# EAGLE design E-P-001-R2.0 (EAGLE 7.3.0)
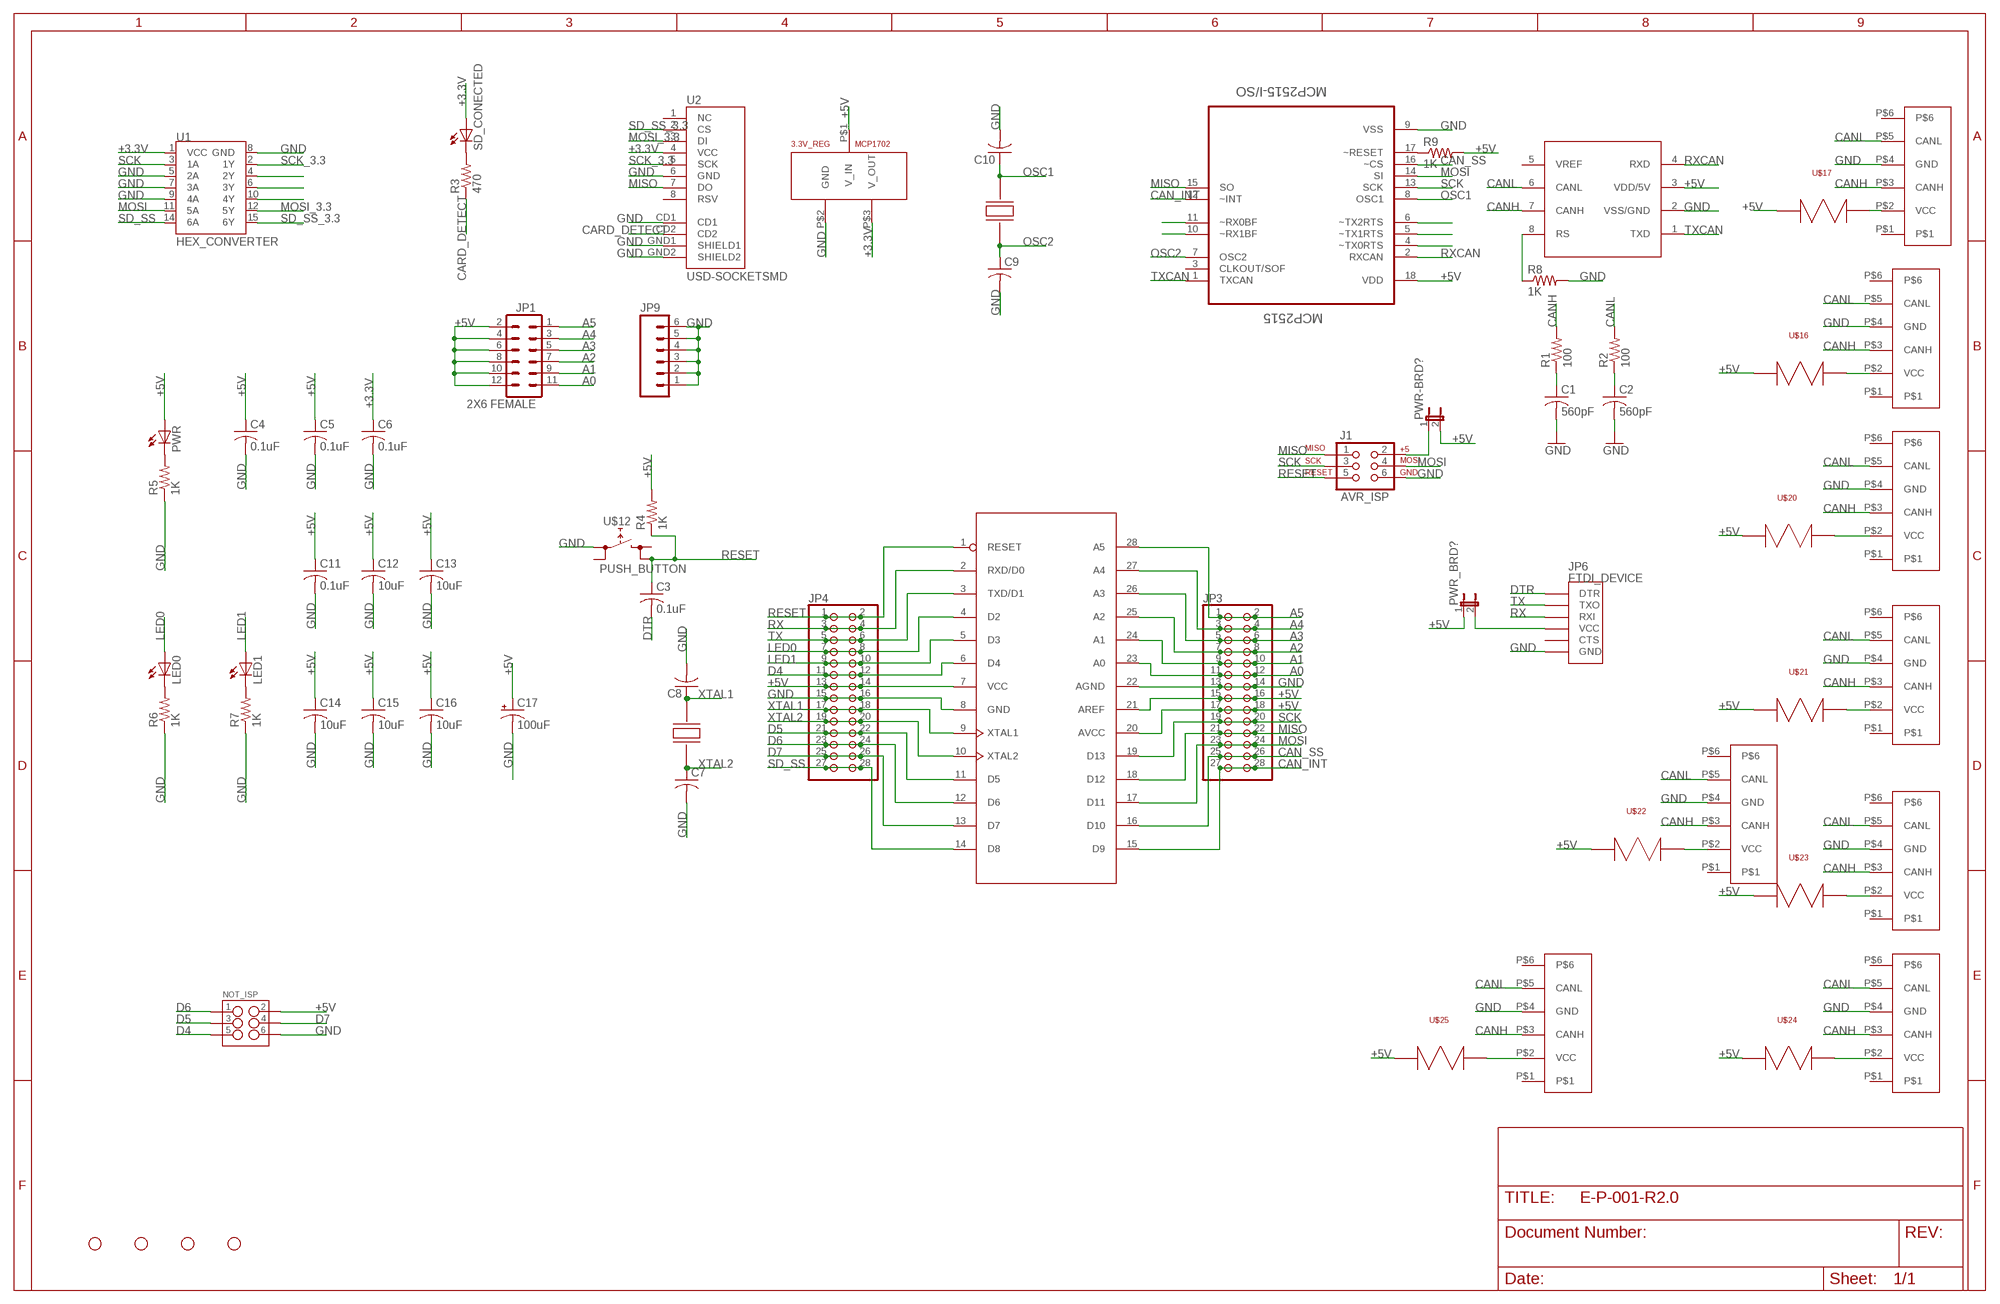
[diagram p0: schematic, sheet 1]

## Parts
3.3V_REG  MCP1702  [SOT-23A]
C1  560pF  C-USC0805  [C0805]
C2  560pF  C-USC0805  [C0805]
C3  0.1uF  C-USC0805  [C0805]
C4  0.1uF  C-USC0805  [C0805]
C5  0.1uF  C-USC0805  [C0805]
C6  0.1uF  C-USC0805  [C0805]
C7  C-USC0805  [C0805]
C8  C-USC0805  [C0805]
C9  C-USC0805  [C0805]
C10  C-USC0805  [C0805]
C11  0.1uF  C-USC0805  [C0805]
C12  10uF  C-USC0805  [C0805]
C13  10uF  C-USC0805  [C0805]
C14  10uF  C-USC0805  [C0805]
C15  10uF  C-USC0805  [C0805]
C16  10uF  C-USC0805  [C0805]
C17  100uF  47UF-50V-20%(ELECT)  [PANASONIC_D]
J1  AVR_ISP  AVR_SPI_PRG_6PTH  [2X3]
JP1  2X6 FEMALE  M06X2PTH_FEMALE  [2X6]
JP3  PINHD-2X14  [2X14]
JP4  PINHD-2X14  [2X14]
JP6  FTDI_DEVICE  [FTDI_DEVICE_SIDE]
JP9  M06SILK_FEMALE_PTH  [1X06]
LED0  LED1206  [LED-1206]
LED1  LED1206  [LED-1206]
MCP2515  MCP2515-I/SO  [SOIC127P1034X264-18N]
NOT_ISP  M03X2FEMALE  [2X3]
PWR  LED1206  [LED-1206]
PWR-BRD?  JP1E  [JP1]
PWR_BRD?  JP1E  [JP1]
R1  100  R-US_M0805  [M0805]
R2  100  R-US_M0805  [M0805]
R3  470  R-US_M0805  [M0805]
R4  1K  R-US_M0805  [M0805]
R5  1K  R-US_M0805  [M0805]
R6  1K  R-US_M0805  [M0805]
R7  1K  R-US_M0805  [M0805]
R8  1K  R-US_M0805  [M0805]
R9  1K  R-US_M0805  [M0805]
SD_CONECTED  LED1206  [LED-1206]
STANDOFF1  STAND-OFF  [STAND-OFF]
STANDOFF2  STAND-OFF  [STAND-OFF]
STANDOFF3  STAND-OFF  [STAND-OFF]
STANDOFF4  STAND-OFF  [STAND-OFF]
U1  HEX_CONVERTER  [SO016]
U2  USD-SOCKETSMD  [MICRO-SD-SOCKET-PP]
U$1  CAN_6P6C  [CAN_6P6C]
U$2  MCP2551DIP  [DIP8]
U$4  ATMEGA328  [DIP28-0.3IN]
U$6  CAN_6P6C  [CAN_6P6C]
U$7  CAN_6P6C  [CAN_6P6C]
U$8  CAN_6P6C  [CAN_6P6C]
U$9  CAN_6P6C  [CAN_6P6C]
U$10  CAN_6P6C  [CAN_6P6C]
U$11  CAN_6P6C  [CAN_6P6C]
U$12  PUSH_BUTTON  [PUSHBUTTON]
U$14  CAN_6P6C  [CAN_6P6C]
U$16  FUSE  [SM_MINI_AUTO-FUSE_HOLDER]
U$17  FUSE  [SM_MINI_AUTO-FUSE_HOLDER]
U$18  CRYSTAL  [7A_CRYSTAL]
U$19  CRYSTAL  [7A_CRYSTAL]
U$20  FUSE  [SM_MINI_AUTO-FUSE_HOLDER]
U$21  FUSE  [SM_MINI_AUTO-FUSE_HOLDER]
U$22  FUSE  [SM_MINI_AUTO-FUSE_HOLDER]
U$23  FUSE  [SM_MINI_AUTO-FUSE_HOLDER]
U$24  FUSE  [SM_MINI_AUTO-FUSE_HOLDER]
U$25  FUSE  [SM_MINI_AUTO-FUSE_HOLDER]

## Nets
+3.3V: 3.3V_REG.P$3(V_OUT) C6.1 SD_CONECTED.A U1.1(VCC) U2.4(VCC)
+5V: 3.3V_REG.P$1(V_IN) C4.1 C5.1 C11.1 C12.1 C13.1 C14.1 C15.1 C16.1 C17.+ JP1.2 JP1.4 JP1.6 JP1.8 JP1.10 JP1.12 JP3.15 JP3.16 JP3.17 JP3.18 JP4.13 JP4.14 MCP2515.18(VDD) NOT_ISP.2 PWR-BRD?.2 PWR.A PWR_BRD?.1 R4.2 R9.2 U$2.3(VDD/5V) U$4.7(VCC) U$4.20(AVCC) U$4.21(AREF) U$16.P$3 U$16.P$4 U$17.P$3 U$17.P$4 U$20.P$3 U$20.P$4 U$21.P$3 U$21.P$4 U$22.P$3 U$22.P$4 U$23.P$3 U$23.P$4 U$24.P$3 U$24.P$4 U$25.P$3 U$25.P$4
A0: JP1.11 JP3.11 JP3.12 U$4.23(A0)
A1: JP1.9 JP3.9 JP3.10 U$4.24(A1)
A2: JP1.7 JP3.7 JP3.8 U$4.25(A2)
A3: JP1.5 JP3.5 JP3.6 U$4.26(A3)
A4: JP1.3 JP3.3 JP3.4 U$4.27(A4)
A5: JP1.1 JP3.1 JP3.2 U$4.28(A5)
CAN_INT: JP3.27 JP3.28 MCP2515.12(~INT) U$4.15(D9)
CAN_SS: JP3.25 JP3.26 MCP2515.16(~CS) U$4.16(D10)
CANH: R1.2 U$1.P$3(CANH) U$2.7(CANH) U$6.P$3(CANH) U$7.P$3(CANH) U$8.P$3(CANH) U$9.P$3(CANH) U$10.P$3(CANH) U$11.P$3(CANH) U$14.P$3(CANH)
CANL: R2.2 U$1.P$5(CANL) U$2.6(CANL) U$6.P$5(CANL) U$7.P$5(CANL) U$8.P$5(CANL) U$9.P$5(CANL) U$10.P$5(CANL) U$11.P$5(CANL) U$14.P$5(CANL)
CARD_DETECT: R3.1 U2.CD2
D4: JP4.11 JP4.12 NOT_ISP.5 U$4.6(D4)
D5: JP4.21 JP4.22 NOT_ISP.3 U$4.11(D5)
D6: JP4.23 JP4.24 NOT_ISP.1 U$4.12(D6)
D7: JP4.25 JP4.26 NOT_ISP.4 U$4.13(D7)
DTR: C3.2 JP6.P$1(DTR)
GND: 3.3V_REG.P$2(GND) C1.2 C2.2 C4.2 C5.2 C6.2 C7.2 C8.2 C9.2 C10.2 C11.2 C12.2 C13.2 C14.2 C15.2 C16.2 C17.- J1.6 JP3.13 JP3.14 JP4.15 JP4.16 JP6.P$6(GND) JP9.1 JP9.2 JP9.3 JP9.4 JP9.5 JP9.6 MCP2515.9(VSS) NOT_ISP.6 R5.1 R6.1 R7.1 R8.2 U1.5(2A) U1.7(3A) U1.8(GND) U1.9(4A) U2.6(GND) U2.CD1 U2.GND1(SHIELD1) U2.GND2(SHIELD2) U$1.P$4(GND) U$2.2(VSS/GND) U$4.8(GND) U$4.22(AGND) U$6.P$4(GND) U$7.P$4(GND) U$8.P$4(GND) U$9.P$4(GND) U$10.P$4(GND) U$11.P$4(GND) U$12.L1(L) U$14.P$4(GND)
LED0: JP4.7 JP4.8 LED0.A U$4.4(D2)
LED1: JP4.9 JP4.10 LED1.A U$4.5(D3)
MISO: J1.1 JP3.21 JP3.22 MCP2515.15(SO) U2.7(DO) U$4.18(D12)
MOSI: J1.4 JP3.23 JP3.24 MCP2515.14(SI) U1.11(5A) U$4.17(D11)
MOSI_3.3: U1.12(5Y) U2.3(DI)
N$1: MCP2515.4(~TX0RTS)
N$2: MCP2515.5(~TX1RTS)
N$3: MCP2515.6(~TX2RTS)
N$4: MCP2515.11(~RX0BF)
N$5: U$14.P$2(VCC) U$22.P$1 U$22.P$2
N$6: U$11.P$2(VCC) U$25.P$1 U$25.P$2
N$7: R3.2 SD_CONECTED.C
N$9: JP6.P$4(VCC) PWR_BRD?.2
N$10: LED0.C R6.2
N$11: LED1.C R7.2
N$12: R8.1 U$2.8(RS)
N$15: MCP2515.17(~RESET) R9.1
N$17: U$10.P$2(VCC) U$24.P$1 U$24.P$2
N$19: PWR.C R5.2
N$21: U$9.P$2(VCC) U$23.P$1 U$23.P$2
N$22: U$8.P$2(VCC) U$21.P$1 U$21.P$2
N$23: U$7.P$2(VCC) U$20.P$1 U$20.P$2
N$24: MCP2515.10(~RX1BF)
N$25: C1.1 R1.1
N$26: C2.1 R2.1
N$27: U1.4(2Y)
N$28: U1.6(3Y)
N$29: U1.10(4Y)
N$30: U$6.P$2(VCC) U$16.P$1 U$16.P$2
N$31: U$1.P$2(VCC) U$17.P$1 U$17.P$2
N$37: J1.2 PWR-BRD?.1
OSC1: C10.1 MCP2515.8(OSC1) U$19.P$2
OSC2: C9.1 MCP2515.7(OSC2) U$19.P$1
RESET: C3.1 J1.5 JP4.1 JP4.2 R4.1 U$4.1(RESET) U$12.R2(R)
RX: JP4.3 JP4.4 JP6.P$3(RXI) U$4.2(RXD/D0)
RXCAN: MCP2515.2(RXCAN) U$2.4(RXD)
SCK: J1.3 JP3.19 JP3.20 MCP2515.13(SCK) U1.3(1A) U$4.19(D13)
SCK_3.3: U1.2(1Y) U2.5(SCK)
SD_SS: JP4.27 JP4.28 U1.14(6A) U$4.14(D8)
SD_SS_3.3: U1.15(6Y) U2.2(CS)
TX: JP4.5 JP4.6 JP6.P$2(TXO) U$4.3(TXD/D1)
TXCAN: MCP2515.1(TXCAN) U$2.1(TXD)
XTAL1: C8.1 JP4.17 JP4.18 U$4.9(XTAL1) U$18.P$2
XTAL2: C7.1 JP4.19 JP4.20 U$4.10(XTAL2) U$18.P$1
Unconnected: JP6.P$5(CTS) MCP2515.3(CLKOUT/SOF) U2.1(NC) U2.8(RSV) U$1.P$1 U$1.P$6 U$2.5(VREF) U$6.P$1 U$6.P$6 U$7.P$1 U$7.P$6 U$8.P$1 U$8.P$6 U$9.P$1 U$9.P$6 U$10.P$1 U$10.P$6 U$11.P$1 U$11.P$6 U$12.L2(L) U$12.R1(R) U$14.P$1 U$14.P$6

## Library data of the parts
3.3V_REG = mylibrary:MCP1702
C1-C16 = adafruit:C-US: CAPACITOR, American symbol
C17 = SparkFun-Capacitors:47UF-50V-20%(ELECT): CAP-10547; PROD_ID: CAP-10547
J1 = E-P-099-R2.2:AVR_SPI_PRG_6: AVR ISP 6 Pin This is the reduced ISP connector for AVR programming. Common on Arduino. This footprint will take up less PCB space and can be used with a 10-pin to 6-pin adapter such as SKU: BOB-08508
JP1 = SparkFun-Connectors:M06X2; PROD_ID: CONN-12423
JP3 JP4 = E-P-099-R2.2:PINHD-2X14: PIN HEADER
JP6 = SparkFun-Connectors:FTDI_DEVICE: Connector which mates to FTDI basic or FTDI cable.
JP9 = SparkFun-Connectors:M06: Header 6 Standard 6-pin 0.1" header. Use with straight break away headers (SKU : PRT-00116), right angle break away headers (PRT-00553), swiss pins (PRT-00743), machine pins (PRT-00117), and female headers (PRT-00115). Molex polarized connector foot print use with SKU : PRT-08094 with associated crimp pins and housings. NOTES ON THE VARIANTS LOCK and LOCK_LONGPADS... This footprint was designed to help hold the alignment of a through-hole component (i.e. 6-pin header) while soldering it into place. You may notice that each hole has been shifted either up or down by 0.005 of an inch from it's more standard position (which is a perfectly straight line). This slight alteration caused the pins (the squares in the middle) to touch the edges of the holes. Because they are alternating, it causes a "brace" to hold the component in place. 0.005 has proven to be the perfect amount of "off-center" position when using our standard breakaway headers. Although looks a little odd when you look at the bare footprint, once you have a header in there, the alteration is very hard to notice. Also,if you push a header all the way into place, it is covered up entirely on the bottom side. This idea of altering the position of holes to aid alignment will be further integrated into the Sparkfun Library for other footprints. It can help hold any component with 3 or more connection pins.; PROD_ID: CONN-08437
LED0 LED1 PWR SD_CONECTED = Shell2013:LED: LEDs Standard schematic elements and footprints for 5mm, 3mm, 1206, and 0603 sized LEDs. 5mm - Spark Fun Electronics SKU : COM-00529 (and others)
MCP2515 = Microchip_By_element14_Batch_1:MCP2515-I/SO: CAN Controller; MPN: MCP2515-I/SO; OC_FARNELL: 1292239; OC_NEWARK: 29H7136; PACKAGE: SOIC-18; SUPPLIER: Microchip
NOT_ISP = SparkFun-Connectors:M03X2: 2x3 .1" header. Shrouded, with keying- CONN-10681 SMT- CONN-11415 Pogo pins- HW-11044; PROD_ID: CONN-11566; VALUE: FEMALE 2x3
PWR-BRD? PWR_BRD? = E-P-099-R2.2:JP1E: JUMPER
R1-R9 = adafruit:R-US_: RESISTOR, American symbol
STANDOFF1-STANDOFF4 = SparkFun-Electromechanical:STAND-OFF: #4 Stand Off This is the mechanical footprint for a #4 phillips button head screw. Use the keepout ring to avoid running the screw head into surrounding components. SKU : PRT-00447
U1 = SparkFun-DigitalIC:HEX_CONVERTER: 74HC4050 Hex Buffer Level Shifter SMD SO016; PROD_ID: IC-09604
U2 = SparkFun:USD-SOCKET: microSD Socket Push-push type uSD socket. Schematic element and footprint production proven. Spark Fun Electronics SKU : PRT-00127. tDoc lines correctly indicate media card edge positions when inserting (unlocked, locked, depressed).
U$1 U$6-U$11 U$14 = Shell2013:CAN_6P6C: Digikey part: 553-2258-ND
U$2 = E-P-099-R2.2:MCP2551
U$4 = E-P-099-R2.2:ATMEGA328
U$12 = E-P-099-R2.2:PUSH_BUTTON
U$16 U$17 U$20-U$25 = mylibrary:FUSE
U$18 U$19 = mylibrary:CRYSTAL

## Board
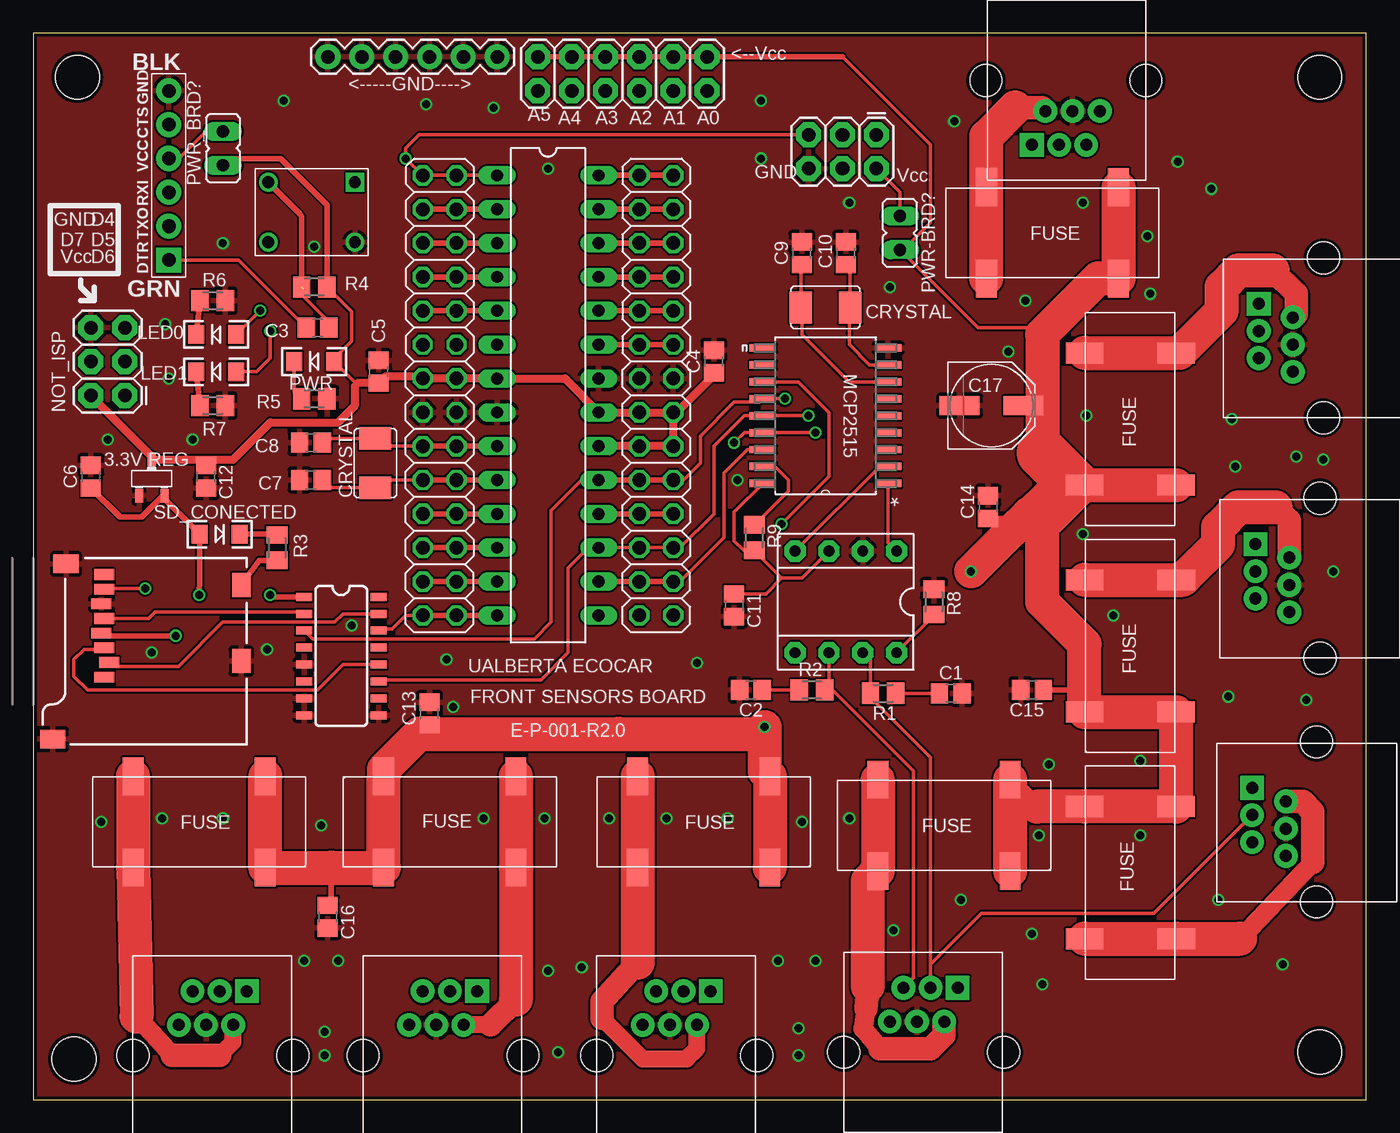
[diagram p1: board, top side]
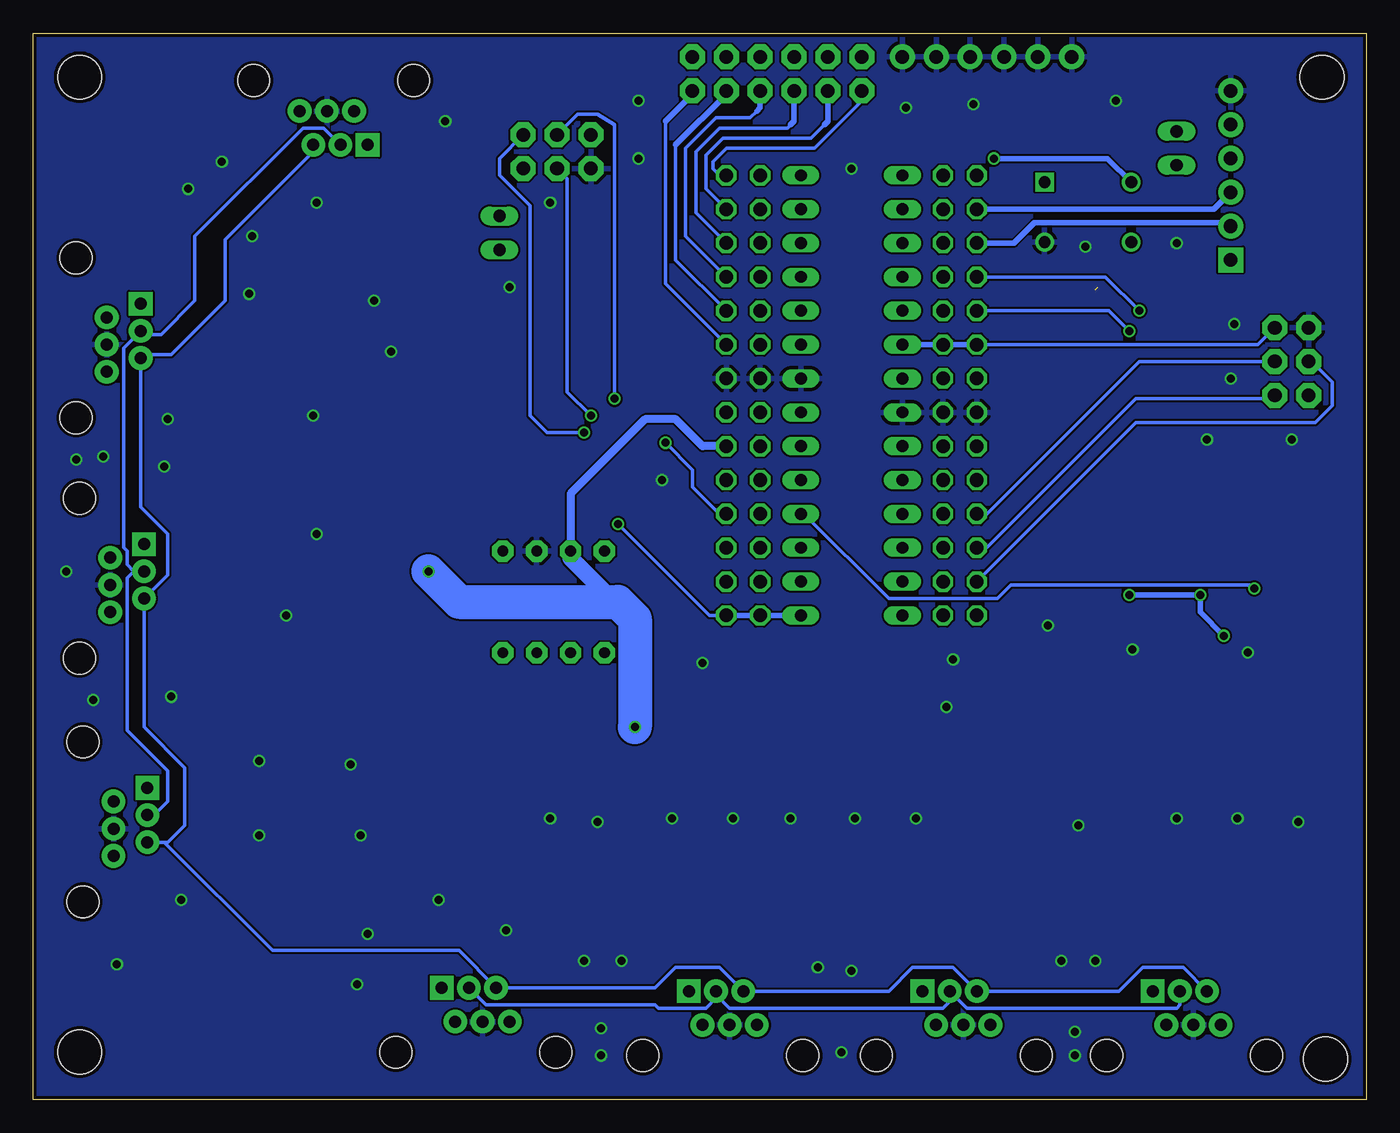
[diagram p2: board, bottom side, seen from below]

Size 100 x 80 mm. Coordinates in mm from the lower left corner, seen from the top.
Outline: 0,0 100,0 100,80 0,80 0,0
Copper layers (1*16): Top 0.035mm / dielectric 1.5mm / Bottom 0.035mm
Design rules "ITEADstudio_DRC": minimum track width 6mil, minimum drill 12mil, track to track 6mil, track to pad 6mil, pad to pad 6mil, via to via 6mil, smd to smd 0mil, copper to edge 10mil, drill to drill 10mil, minimum pad ring 10mil, minimum via ring 6mil, stop-mask expansion 2mil, vias tented up to drill 100mil, thermal gap 10mil

### Footprints (pad centres in the part's own frame; a part is rotated, then mirrored left to right if it is on the bottom)
SOT-23A = smd 0.6 x 1: P$1 0,0; P$2 -0.95,-2.7; P$3 0.95,-2.7
C0805 = smd 1.3 x 1.5: 1 -0.85,0; 2 0.85,0
PANASONIC_D = smd 3 x 1.4: + 2.4,0; - -2.4,0
2X3 = drill 1.016 pad 1.88 octagon: 1 0,0; 2 0,2.54; 3 2.54,0; 4 2.54,2.54; 5 5.08,0; 6 5.08,2.54
2X6 = drill 1.016 pad 1.88 octagon: 1 0,0; 2 0,2.54; 3 2.54,0; 4 2.54,2.54; 5 5.08,0; 6 5.08,2.54; 7 7.62,0; 8 7.62,2.54; 9 10.16,0; 10 10.16,2.54; 11 12.7,0; 12 12.7,2.54
2X14 = drill 1.016 octagon: 1 -16.51,-1.27; 2 -16.51,1.27; 3 -13.97,-1.27; 4 -13.97,1.27; 5 -11.43,-1.27; 6 -11.43,1.27; 7 -8.89,-1.27; 8 -8.89,1.27; 9 -6.35,-1.27; 10 -6.35,1.27; 11 -3.81,-1.27; 12 -3.81,1.27; 13 -1.27,-1.27; 14 -1.27,1.27; 15 1.27,-1.27; 16 1.27,1.27; 17 3.81,-1.27; 18 3.81,1.27; 19 6.35,-1.27; 20 6.35,1.27; 21 8.89,-1.27; 22 8.89,1.27; 23 11.43,-1.27; 24 11.43,1.27; 25 13.97,-1.27; 26 13.97,1.27; 27 16.51,-1.27; 28 16.51,1.27
FTDI_DEVICE_SIDE = drill 1.016 pad 1.88 square: P$1 -6.35,0 | drill 1.016 pad 1.88: P$2 -3.81,0; P$3 -1.27,0; P$4 1.27,0; P$5 3.81,0; P$6 6.35,0
1X06 = drill 1.016 pad 1.88: 1 0,0; 2 2.54,0; 3 5.08,0; 4 7.62,0; 5 10.16,0; 6 12.7,0
LED-1206 = smd 1.2 x 1.4: A -1.5,0; C 1.5,0
SOIC127P1034X264-18N = smd 1.981 x 0.559: 1 -4.699,5.08; 2 -4.699,3.81; 3 -4.699,2.54; 4 -4.699,1.27; 5 -4.699,0; 6 -4.699,-1.27; 7 -4.699,-2.54; 8 -4.699,-3.81; 9 -4.699,-5.08; 10 4.699,-5.08; 11 4.699,-3.81; 12 4.699,-2.54; 13 4.699,-1.27; 14 4.699,0; 15 4.699,1.27; 16 4.699,2.54; 17 4.699,3.81; 18 4.699,5.08
JP1 = drill 0.914 long: 1 0,-1.27; 2 0,1.27
M0805 = smd 1.3 x 1.6: 1 -0.95,0; 2 0.95,0
STAND-OFF = hole 3.302: 0,0
SO016 = smd 0.6 x 1.2: 1 -4.445,-2.8; 2 -3.175,-2.8; 3 -1.905,-2.8; 4 -0.635,-2.8; 5 0.635,-2.8; 6 1.905,-2.8; 7 3.175,-2.8; 8 4.445,-2.8; 9 4.445,2.8; 10 3.175,2.8; 11 1.905,2.8; 12 0.635,2.8; 13 -0.635,2.8; 14 -1.905,2.8; 15 -3.175,2.8; 16 -4.445,2.8
MICRO-SD-SOCKET-PP = smd 0.8 x 1.5: 1 -8.94,10.7; 2 -7.84,10.3; 3 -6.74,10.7; 4 -5.64,10.9; 5 -4.54,10.7; 6 -3.44,10.9; 7 -2.34,10.7; 8 -1.24,10.7 | smd 1.8 x 1.4: CD1 -7.75,0.4; CD2 -2.05,0.4 | smd 1.4 x 1.9: GND1 -13.6,14.55; GND2 -0.45,13.55
CAN_6P6C = drill 0.9 pad 1.778 square: P$1 4.08,0 | drill 0.9 pad 1.778: P$2 3.06,-2.54; P$3 2.04,0; P$4 1.02,-2.54; P$5 0,0; P$6 -1.02,-2.54 | hole 2.4: -4.47,-4.84; 7.53,-4.84
DIP8 = drill 0.813 pad 1.6 octagon: 1 1.27,-3.81; 2 3.81,-3.81; 3 6.35,-3.81; 4 8.89,-3.81; 5 8.89,3.81; 6 6.35,3.81; 7 3.81,3.81; 8 1.27,3.81
DIP28-0.3IN = drill 0.889 long: 1 -16.51,-3.81; 2 -13.97,-3.81; 3 -11.43,-3.81; 4 -8.89,-3.81; 5 -6.35,-3.81; 6 -3.81,-3.81; 7 -1.27,-3.81; 8 1.27,-3.81; 9 3.81,-3.81; 10 6.35,-3.81; 11 8.89,-3.81; 12 11.43,-3.81; 13 13.97,-3.81; 14 16.51,-3.81; 15 16.51,3.81; 16 13.97,3.81; 17 11.43,3.81; 18 8.89,3.81; 19 6.35,3.81; 20 3.81,3.81; 21 1.27,3.81; 22 -1.27,3.81; 23 -3.81,3.81; 24 -6.35,3.81; 25 -8.89,3.81; 26 -11.43,3.81; 27 -13.97,3.81; 28 -16.51,3.81
PUSHBUTTON = drill 0.889: L1 0,4.5; R1 6.5,4.5; R2 6.5,0 | drill 0.889 square: L2 0,0
SM_MINI_AUTO-FUSE_HOLDER = smd 1.57 x 2.82: P$1 -4.96,3.43; P$2 -4.96,-3.43; P$3 4.96,3.43; P$4 4.96,-3.43
7A_CRYSTAL = smd 1.7 x 2.4: P$1 -1.85,0; P$2 1.85,0

### Placement (x,y rotation side)
3.3V_REG  8.89,48.01 0 top
C1  68.83,30.48 0 top
C2  53.85,30.73 180 top
C3  21.34,57.91 180 top
C4  51.05,55.37 90 top
C5  25.91,54.61 90 top
C6  4.32,46.74 90 top
C7  20.83,46.48 180 top
C8  20.83,49.28 180 top
C9  57.66,63.5 90 top
C10  60.96,63.5 90 top
C11  52.58,37.08 270 top
C12  12.95,46.74 270 top
C13  29.72,28.96 90 top
C14  71.63,44.45 90 top
C15  74.93,30.73 180 top
C16  22.1,13.72 270 top
C17  71.88,52.07 0 top
J1  63.25,72.39 180 top
JP1  37.85,75.69 0 top
JP3  46.74,52.83 270 top
JP4  30.48,52.83 270 top
JP6  10.16,69.34 90 top
JP9  22.1,78.23 0 top
LED0  13.72,57.4 180 top
LED1  13.72,54.61 180 top
MCP2515  59.44,51.31 180 top
NOT_ISP  6.86,52.83 90 top
PWR  21.08,55.37 180 top
PWR-BRD?  65.02,65.02 180 top
PWR_BRD?  14.22,71.37 0 top
R1  63.75,30.48 180 top
R2  58.42,30.73 0 top
R3  18.29,41.4 90 top
R4  21.08,60.96 0 top
R5  21.08,52.58 180 top
R6  13.46,59.94 180 top
R7  13.46,52.07 180 top
R8  67.56,37.34 90 top
R9  54.1,42.16 270 top
SD_CONECTED  13.97,42.42 0 top
STANDOFF1  3.3,76.71 0 top
STANDOFF2  3.05,3.05 0 top
STANDOFF3  96.52,76.71 0 top
STANDOFF4  96.52,3.56 0 top
U1  23.11,33.27 270 top
U2  16,40.64 90 top
U$1  91.95,55.63 90 top
U$2  66.04,37.34 180 top
U$4  38.61,52.83 270 top
U$6  91.69,37.59 90 top
U$7  91.44,19.3 90 top
U$8  78.99,71.63 180 top
U$9  65.28,8.38 0 top
U$10  46.74,8.13 0 top
U$11  29.21,8.13 0 top
U$12  24.13,68.83 180 top
U$14  11.94,8.13 0 top
U$16  82.3,34.04 270 top
U$17  82.3,51.05 270 top
U$18  25.65,47.75 90 top
U$19  59.44,59.44 0 top
U$20  82.3,17.02 90 top
U$21  76.45,65.02 0 top
U$22  12.45,20.83 0 top
U$23  68.33,20.57 0 top
U$24  50.29,20.83 0 top
U$25  31.24,20.83 180 top

### Tracks (layer width: path | path; a pad name or v marks a point on that pad's centre or on a via)
+3.3V  (via drill 0.6)
  Top 0.406: C6.1 6.52,43.69 8.13,43.69 9.75,45.31 3.3V_REG.P$3 9.84,45.05 SD_CONECTED.A 12.47,39.14 v12.45,37.85 | v10.67,34.8 5.56,34.8 U2.4 | U1.1 17.91,37.72 v17.78,37.85
  Bottom 0.406: v10.67,34.8 12.45,36.58 v12.45,37.85 v17.78,37.85
+5V  (via drill 0.6)
  Top 0.254: 26.37,54.23 C5.1 | R4.2 23.88,59.12 23.88,56.9 22.58,55.6 PWR.A 24.19,53.76 24.38,53.76 24.13,53.51 | 3.3V_REG.P$1 8.89,48.26 | 56.13,39.12 54.1,41.15 R9.2 53.27,41.21 52.58,41.91 52.58,44.07 MCP2515.18 | 56.13,39.12 57.66,39.12 U$2.3 | JP3.16 48.26,51.56 | JP3.18 JP3.17 | 75.95,57.66 75.69,57.91 70.87,57.91 PWR-BRD?.2 65.28,63.75 67.31,65.79 67.31,71.63 60.71,78.23 | C11.1 54.95,37.93 56.13,39.12
  Top 0.406: 29.09,54.23 JP4.13 | JP1.2 JP1.4 JP1.6 JP1.8 JP1.10 JP1.12 60.71,78.23 | C13.1 43.94,27.43 | C14.1 73.28,43.6 73.28,42.55 | C15.1 78.87,30.73 78.87,29.97 | C16.1 22.35,14.57 22.35,17.4 | C17.+ 75.69,52.07 75.69,51.82 | R4.2 22.03,67.12 18.54,70.61 14.73,70.61 PWR_BRD?.1
  Top 0.61: JP4.13 JP4.14 U$4.7 39.88,54.1 U$4.21 JP3.15 JP3.16 JP3.18 U$4.20 | 29.09,54.23 26.37,54.23 | C5.1 24.38,53.76 | 3.3V_REG.P$1 13.21,48.01 | 13.21,48.01 14.99,48.01 17.78,50.8 22.86,50.8 24.13,52.07 24.13,53.51 | 8.89,48.26 NOT_ISP.2 | 48.26,51.56 51.05,54.36 C4.1 | C12.1 12.95,47.75 13.21,48.01
  Top 1.27: 75.95,57.66 75.69,57.4 | 77.98,46.23 78.73,46.23 U$17.P$4 | 75.31,21.98 U$23.P$3 | 75.69,43.94 74.68,43.94 | 54.86,24.65 U$24.P$3 | U$25.P$4 26.28,24.76 | 54.36,27.43 v54.86,27.94
  Top 2.54: U$21.P$3 U$21.P$4 79.88,61.59 75.95,57.66 | 75.69,57.4 75.69,51.82 75.69,48.51 | U$17.P$4 U$17.P$3 | 75.69,43.94 75.69,37.34 78.87,34.16 78.87,29.97 U$16.P$4 U$16.P$3 U$20.P$4 U$20.P$3 75.31,21.98 | U$23.P$3 U$23.P$4 | 74.68,43.94 73.28,42.55 v70.36,39.62 | v54.86,27.94 54.86,24.65 | U$24.P$3 U$24.P$4 | U$25.P$4 U$25.P$3 22.35,17.4 U$22.P$4 U$22.P$3 | 26.28,24.76 28.96,27.43 43.94,27.43 54.36,27.43
  Top 3.81: 75.69,48.51 77.98,46.23 75.69,43.94
  Bottom 0.61: JP3.18 49.78,49.02 51.82,51.05 54.1,51.05 59.69,45.47 U$2.3
  Bottom 1.27: U$2.3 59.69,40.64 56.39,37.34 56.13,37.34
  Bottom 2.54: v70.36,39.62 68.07,37.34 56.13,37.34 54.86,36.07 v54.86,27.94
A0
  Top 0.406: JP3.12 JP3.11 U$4.23
  Bottom 0.254: JP3.12 52.58,61.21 52.58,73.41
  Bottom 0.406: JP1.11 50.55,75.44 52.58,73.41
A1
  Top 0.406: U$4.24 JP3.9 JP3.10
  Bottom 0.254: 51.82,71.63 51.82,62.99 JP3.10
  Bottom 0.406: JP1.9 48.01,75.44 51.82,71.63
A2
  Top 0.406: JP3.8 JP3.7 U$4.25
  Bottom 0.254: 45.72,74.17 46.23,73.66 48.77,73.66 51.05,71.37 51.05,64.77 JP3.8
  Bottom 0.406: JP1.7 45.47,74.42 45.72,74.17
A3
  Top 0.406: U$4.26 JP3.5 JP3.6
  Bottom 0.254: 43.18,73.15 43.43,72.9 48.51,72.9 50.29,71.12 50.29,66.55 JP3.6
  Bottom 0.406: JP1.5 42.93,73.41 43.18,73.15
A4
  Top 0.406: JP3.4 JP3.3 U$4.27
  Bottom 0.254: 40.64,73.15 41.66,72.14 48.26,72.14 49.53,70.87 49.53,68.33 JP3.4
  Bottom 0.406: JP1.3 40.39,73.41 40.64,73.15
A5
  Top 0.406: U$4.28 JP3.1 JP3.2
  Bottom 0.254: JP3.2 48.51,69.34 49.02,69.85 49.02,70.36 48.01,71.37 41.4,71.37 37.85,74.93 JP1.1
CAN_INT  (via drill 0.6)
  Top 0.254: v56.13,43.18 59.69,46.74 59.69,51.56 57.4,53.85 MCP2515.12
  Bottom 0.254: JP3.28 49.28,36.32 v56.13,43.18
  Bottom 0.406: JP3.28 JP3.27 U$4.15
CAN_SS
  Top 0.254: JP3.26 48.51,38.86 51.82,42.16 51.82,46.99 53.59,48.77 MCP2515.16
  Top 0.406: U$4.16 JP3.25 JP3.26
CANH
  Top 0.254: U$7.P$3 84.07,13.97 71.89,13.97 71.12,13.97 67.31,10.16 | 62.74,30.41 R1.2 62.8,32.95 U$2.7 | 62.74,30.23 67.31,25.65 67.31,10.16 | 67.31,10.16 U$9.P$3
  Top 0.406: 62.74,30.41 62.74,30.23 | U$9.P$3
  Bottom 0.254: U$8.P$3 76.96,71.63 78.23,72.9 79.76,72.9 87.88,64.77 87.88,59.94 90.42,57.4 91.69,57.4 U$1.P$3 91.95,57.4 92.2,57.4 93.22,56.39 93.22,41.4 92.96,41.15 92.96,40.13 92.46,39.62 | 92.46,39.62 91.7,39.62 U$6.P$3 | U$7.P$3 90.92,21.34 89.92,22.35 89.92,24.64 92.96,27.69 92.96,39.12 92.46,39.62 | U$9.P$3 66.04,7.11 53.34,7.11 53.09,6.86 49.53,6.86 48.77,7.62 48.77,8.12 U$10.P$3 48.78,7.88 47.75,6.86 31.75,6.86 31.24,7.37 U$11.P$3 29.97,6.86 14.22,6.86 13.97,7.11 U$14.P$3
CANL
  Top 0.254: U$2.6 59.69,31.05 R2.2 59.94,30.73 66.04,24.64 66.04,9.14 U$9.P$5
  Bottom 0.254: U$8.P$5 78.99,71.12 85.6,64.52 85.6,59.94 89.66,55.88 91.69,55.88 U$1.P$5 91.95,44.45 89.92,42.42 89.92,39.37 U$6.P$5 91.69,27.94 88.65,24.89 88.65,20.57 89.92,19.3 U$7.P$5 90.17,19.3 82.04,11.18 68.07,11.18 U$9.P$5 53.34,8.38 51.82,9.91 48.51,9.91 U$10.P$5 35.81,8.13 34.04,9.91 30.99,9.91 U$11.P$5 18.54,8.13 16.76,9.91 13.72,9.91 U$14.P$5
CARD_DETECT
  Top 0.406: R3.1 16.96,40.45 U2.CD2
D4
  Bottom 0.254: JP4.11 8.13,56.64 NOT_ISP.5
  Bottom 0.406: U$4.6 JP4.12 JP4.11
D5
  Top 0.406: U$4.11 JP4.22 JP4.21
  Bottom 0.254: JP4.21 28.45,43.94 17.02,55.37 NOT_ISP.3
D6
  Top 0.406: U$4.12 JP4.24 JP4.23
  Bottom 0.254: JP4.23 28.45,41.4 17.27,52.58 7.11,52.58 NOT_ISP.1
D7
  Top 0.406: U$4.13 JP4.26 JP4.25
  Bottom 0.254: NOT_ISP.4 4.06,55.37 2.54,53.85 2.54,52.07 3.81,50.8 17.27,50.8 JP4.25
DTR
  Top 0.254: JP6.P$1 15.41,62.99 C3.2
GND  (via drill 0.6)
  other vias: 20.32,10.41 22.86,10.41 21.84,5.08 21.84,3.3 39.37,3.56 38.61,9.65 41.15,9.91 55.88,10.41 58.67,10.41 57.4,5.33 57.4,3.3 75.69,8.64 74.93,12.45 69.6,14.99 93.73,10.16 88.9,14.99 95.5,29.97 89.66,30.23 97.54,39.62 94.74,48.26 90.17,47.5 89.92,51.05 96.77,48.01 83.82,60.45 85.85,70.36 88.39,68.33 83.57,64.77 78.74,67.31 69.09,73.41 74.42,59.94 73.15,56.13 78.99,51.31 78.74,42.42 81.03,36.32 83.06,25.4 83.06,19.81 75.44,19.81 76.2,25.15 64.52,12.7 61.21,21.08 57.66,20.83 52.07,21.08 47.5,21.08 43.18,21.08 31.5,29.46 49.78,32.77 38.35,21.08 33.78,21.08 21.59,20.57 14.22,21.08 9.65,21.08 5.08,20.83 23.88,35.56 11.94,49.53 10.16,54.1 9.91,58.17 14.22,64.26 38.61,69.85 34.54,74.42 29.46,74.68 18.8,74.93 54.61,74.93 54.61,70.61 64.26,60.96 5.59,49.53 61.21,67.31 52.83,46.48 21.08,64.01 30.99,33.02 8.89,33.53 17.53,33.78
  pour Top: -10.16,0 -10.16,80.01 100.33,80.01 100.33,0
  pour Bottom: -13.97,80.01 100.33,80.01 100.33,0 -13.97,0
LED0  (via drill 0.6)
  Top 0.254: v17.02,59.18 16.23,58.42 LED0.A
  Top 0.406: U$4.4 JP4.8 JP4.7
  Bottom 0.254: JP4.7 19.56,61.72 v17.02,59.18
LED1  (via drill 0.6)
  Top 0.254: v17.78,57.66 17.78,55.63 16.76,54.61 LED1.A
  Top 0.406: U$4.5 JP4.10 JP4.9
  Bottom 0.254: JP4.9 19.3,59.18 v17.78,57.66
MISO  (via drill 0.6)
  Top 0.254: v52.58,49.28 53.34,50.04 MCP2515.15 v58.67,50.04 | v8.38,38.35 4.85,38.35 U2.7
  Top 0.406: U$4.18 JP3.21 JP3.22
  Bottom 0.254: JP3.22 48.51,43.94 50.55,45.97 50.55,47.24 v52.58,49.28 | v58.67,50.04 61.47,50.04 62.74,51.31 62.74,67.06 65.02,69.34 65.02,70.61 J1.1 | U$4.18 42.16,43.94 35.81,37.59 27.69,37.59 26.67,38.61 8.64,38.61 v8.38,38.35
MOSI  (via drill 0.6)
  Top 0.254: v58.17,51.31 MCP2515.14 53.34,51.31 51.05,49.02 51.05,43.94 48.51,41.4 JP3.24 JP3.23 U$4.17 41.66,41.4 40.13,39.88 40.13,33.53 38.1,31.5 26.04,31.5 U1.11
  Bottom 0.254: v58.17,51.31 59.94,53.09 59.94,69.09 J1.4
MOSI_3.3
  Top 0.254: U1.12 23.24,32.64 21.34,30.73 4.06,30.73 3.05,31.75 3.05,33.02 3.81,33.78 4.68,33.78 U2.3
N$5
  Top 1.27: 13.97,3.3 14.99,4.32 14.99,5.58 U$14.P$2
  Top 1.422: 7.74,6.23 10.41,3.3
  Top 1.778: 10.41,3.3 13.97,3.3
  Top 2.54: U$22.P$1 U$22.P$2 7.74,6.23
N$6
  Top 1.27: 34.29,5.59 U$11.P$2
  Top 1.778: 36.2,7.5 34.29,5.59
  Top 2.54: U$25.P$2 U$25.P$1 36.2,7.5
N$7
  Top 0.406: SD_CONECTED.C 18.29,42.42 R3.2
N$9
  Top 0.254: JP6.P$4 10.92,70.61 12.95,72.64 PWR_BRD?.2
N$10
  Top 0.406: LED0.C R6.2
N$11
  Top 0.406: LED1.C R7.2
N$12
  Top 0.254: R8.1 67.56,36.32 U$2.8
N$15
  Top 0.254: MCP2515.17 55.63,47.5 56.64,46.48 56.64,45.65 R9.1
N$17
  Top 1.27: 42.67,6.1 45.72,3.05 49.02,3.05 49.78,3.81 49.78,5.58 U$10.P$2
  Top 1.778: 45.33,10.28 42.67,7.37 42.67,6.1
  Top 2.54: U$24.P$1 U$24.P$2 45.33,10.28
N$19
  Top 0.254: PWR.C 19.58,53.13 R5.2
N$21
  Top 1.27: 68.33,5.83 U$9.P$2
  Top 1.422: 62.48,6.86 62.23,5.33 63.5,3.81
  Top 1.778: 62.6,8.5 62.48,6.86 | 63.5,3.81 67.31,3.81 68.33,4.83 68.33,5.83
  Top 2.54: U$23.P$1 U$23.P$2 62.6,16.38 62.6,8.5
N$22
  Top 1.27: 75.68,74.42 U$8.P$2
  Top 1.778: 73.66,74.42 75.68,74.42
  Top 2.54: U$21.P$2 U$21.P$1 71.49,72.26 73.66,74.42
N$23
  Top 1.27: 93.99,22.35 U$7.P$2
  Top 1.422: 90.54,12.06 96.01,17.78
  Top 1.778: 96.01,17.78 96.01,21.59 95.25,22.35 93.99,22.35
  Top 2.54: U$20.P$1 U$20.P$2 90.54,12.06
N$25
  Top 0.254: R1.1 C1.1
N$26
  Top 0.254: R2.1 C2.1
N$30
  Top 1.27: 86.23,39 86.36,38.86 86.36,39.12
  Top 1.778: 93.22,44.45 94.23,43.43 U$6.P$2
  Top 2.54: U$16.P$2 U$16.P$1 86.23,39 | 86.36,39.12 88.9,41.66 88.9,42.93 90.42,44.45 93.22,44.45
N$31
  Top 1.27: U$17.P$1 85.99,56.01
  Top 1.778: 92.96,62.23 94.74,60.45 94.74,58.94 U$1.P$2
  Top 2.54: U$17.P$2 U$17.P$1 | 85.99,56.01 89.15,59.18 89.15,60.96 90.42,62.23 92.96,62.23
N$37
  Top 0.254: PWR-BRD?.1 65.02,68.07 J1.2
OSC1
  Top 0.254: MCP2515.8 62.74,55.12 61.21,56.64 61.21,59.36 U$19.P$2 61.29,62.32 C10.1
OSC2
  Top 0.254: MCP2515.7 61.21,53.85 57.66,57.4 57.66,59.36 U$19.P$1 57.59,62.58 C9.1
RESET  (via drill 0.6)  (1 unrouted)
  Top 0.254: U$4.1 JP4.2 JP4.1 v27.94,70.61 27.94,71.37 28.96,72.39 J1.5 | C3.1 22.19,58.33 20.32,60.2 20.32,60.77
  Top 0.406: R4.1 20.13,66.23 19.98,66.48 U$12.R2
  Bottom 0.406: v27.94,70.61 19.41,70.61 U$12.R2
RX
  Top 0.406: U$4.2 JP4.4 JP4.3
  Bottom 0.406: JP4.3 11.43,66.8 JP6.P$3
RXCAN
  Top 0.254: MCP2515.2 63.5,47.5 U$2.4
SCK  (via drill 0.6)
  Top 0.254: JP3.20 48.77,46.48 50.04,47.75 50.04,49.78 52.58,52.32 54.48,52.32 MCP2515.13 v56.39,52.58 | U$4.19 41.15,46.48 38.86,44.2 38.86,35.81 37.59,34.54 20.95,34.54 U1.3
  Top 0.406: U$4.19 JP3.19 JP3.20
  Bottom 0.254: v56.39,52.58 56.39,73.15 57.66,73.91 59.18,73.91 J1.3
SCK_3.3
  Top 0.254: U2.5 8.67,36.1 9.14,36.58 20.19,36.58 U1.2
SD_SS
  Top 0.254: JP4.27 27.94,36.32 26.92,35.31 26.04,35.31 U1.14
  Top 0.406: U$4.14 JP4.28 JP4.27
SD_SS_3.3
  Top 0.254: U1.15 23.24,36.45 22.61,35.81 14.22,35.81 10.92,32.51 5.48,32.51 U2.2
TX
  Top 0.406: U$4.3 JP4.6 JP4.5
  Bottom 0.406: JP4.5 26.42,64.26 24.89,65.79 10.41,65.79 JP6.P$2
TXCAN
  Top 0.254: MCP2515.1 64.14,41.78 U$2.1
XTAL1
  Top 0.254: JP4.17 26.23,49.02 U$18.P$2 22,49.6 C8.1
  Top 0.406: U$4.9 JP4.18 JP4.17
XTAL2
  Top 0.254: JP4.19 26.23,46.48 U$18.P$1 22.26,45.9 C7.1
  Top 0.406: U$4.10 JP4.20 JP4.19

### Text on the board
tPlace: <--Vcc | <-----GND----> | A5 | A4 | A3 | A2 | A1 | A0 | GND | Vcc | GND | D4 | D7 | D5 | Vcc | D6 | UALBERTA ECOCAR | FRONT SENSORS BOARD | E-P-001-R2.0
tNames: 3.3V REG